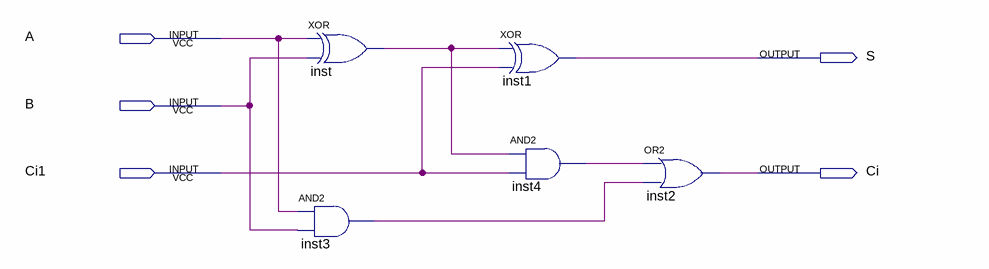
[diagram p0: schematic sheet]
// Quartus schematic somador.bdf as structural Verilog: 5 symbols, 5 pins
module somador (
  input  A,
  input  B,
  input  Ci1,
  output S,
  output Ci
);

  wire inst3_out, inst4_out, inst_out;

  xor inst (inst_out, A, B);
  and inst3 (inst3_out, A, B);
  xor inst1 (S, inst_out, Ci1);
  and inst4 (inst4_out, inst_out, Ci1);
  or inst2 (Ci, inst4_out, inst3_out);
endmodule
